# EAGLE schematic usbasp-dtoy (EAGLE 5.07)
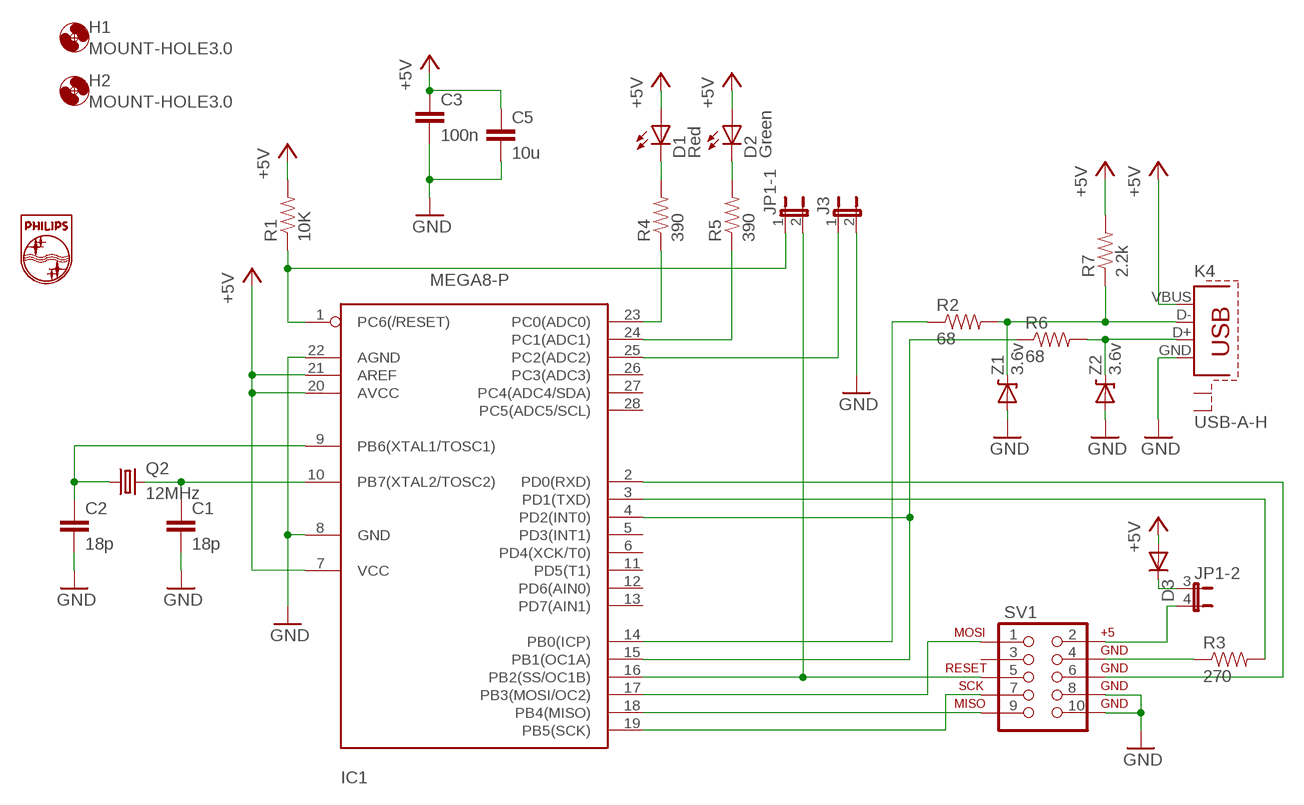
[diagram p0: schematic, sheet 1]

## Parts
C1  18p  C-EUC0805  [C0805]
C2  18p  C-EUC0805  [C0805]
C3  100n  CAPPTH1  [CAP-PTH-5MM]
C5  10u  C-EUC1206K  [C1206K]
D1  Red  LED3MM  [LED3MM]
D2  Green  LED3MM  [LED3MM]
D3  DIODE1N4148  [DIODE-1N4148]
H1  MOUNT-HOLE3.0  [3,0]
H2  MOUNT-HOLE3.0  [3,0]
IC1  MEGA8-P  [DIL28-3]
J3  JP1E  [JP1]
JP1  JP2QE-2X2  [JP2Q]
K4  USB-A-H  [USB-A-H]
Q2  12MHz  CRYSTALHC49UV  [HC49U-V]
R1  10K  RESISTOR1/4W  [AXIAL-0.3]
R2  68  RESISTOR0207/10  [0207/10]
R3  270  RESISTOR1/4W  [AXIAL-0.3]
R4  390  RESISTOR0207/10  [0207/10]
R5  390  RESISTOR0207/10  [0207/10]
R6  68  RESISTOR0207/10  [0207/10]
R7  2.2k  RESISTOR0207/10  [0207/10]
SV1  AVR_SPI_PROG2LOCK  [2X5-SHROUDED_LOCK]
Z1  3.6v  DIODE-ZENERPTH  [DIODE-ZENER]
Z2  3.6v  DIODE-ZENERPTH  [DIODE-ZENER]

## Nets
+5V: C3.1 C5.1 D1.A D2.A D3.A IC1.7(VCC) IC1.20(AVCC) IC1.21(AREF) K4.VBUS R1.P$2 R7.2
GND: C1.2 C2.2 C3.2 C5.2 IC1.8(GND) IC1.22(AGND) J3.2 K4.GND SV1.8 SV1.10 Z1.P$2(A) Z2.P$2(A)
N$1: K4.D- R2.2 R7.1 Z1.P$1(C)
N$2: K4.D+ R6.2 Z2.P$1(C)
N$3: C1.1 IC1.10(PB7(XTAL2/TOSC2)) Q2.2
N$4: C2.1 IC1.9(PB6(XTAL1/TOSC1)) Q2.1
N$5: JP1.4 SV1.2
N$6: R3.P$1 SV1.4
N$7: IC1.3(PD1(TXD)) R3.P$2
N$8: IC1.2(PD0(RXD)) SV1.6
N$9: IC1.17(PB3(MOSI/OC2)) SV1.1
N$10: IC1.19(PB5(SCK)) SV1.7
N$11: IC1.18(PB4(MISO)) SV1.9
N$12: IC1.16(PB2(SS/OC1B)) JP1.2 SV1.5
N$13: IC1.1(PC6(/RESET)) JP1.1 R1.P$1
N$14: IC1.14(PB0(ICP)) R2.1
N$15: IC1.25(PC2(ADC2)) J3.1
N$16: IC1.23(PC0(ADC0)) R4.1
N$17: IC1.24(PC1(ADC1)) R5.1
N$18: IC1.4(PD2(INT0)) IC1.15(PB1(OC1A)) R6.1
N$19: D1.K(C) R4.2
N$20: D2.K(C) R5.2
N$21: D3.C JP1.3
Unconnected: IC1.5(PD3(INT1)) IC1.6(PD4(XCK/T0)) IC1.11(PD5(T1)) IC1.12(PD6(AIN0)) IC1.13(PD7(AIN1)) IC1.26(PC3(ADC3)) IC1.27(PC4(ADC4/SDA)) IC1.28(PC5(ADC5/SCL)) K4.GND@1(S1) K4.GND@2(S2) SV1.3

## Library data of the parts
C1 C2 C5 = rcl:C-EU: CAPACITOR, European symbol
C3 = digital-toy:CAP: Capacitor Standard 0603 ceramic capacitor, and 0.1" leaded capacitor.
D1 D2 = digital-toy:LED: LEDs Standard schematic elements and footprints for 5mm, 3mm, 1206, and 0603 sized LEDs. 5mm - Spark Fun Electronics SKU : COM-00529 (and others) copy led.lbr 0805 led here, by hyl digital-toy. 2010.6.29
D3 = digital-toy:DIODE: Diode These are standard reverse protection diodes and small signal diodes. SMA package can handle up to about 1A. SOD-323 can handle about 200mA. What the SOD-323 package when ordering, there are some mfgs out there that are 5-pin packages.
H1 H2 = holes:MOUNT-HOLE: MOUNTING HOLE with drill center marker
IC1 = atmel:MEGA8-P: MICROCONTROLLER 8 Kbytes FLASH 1 kbytes SRAM 512 bytes EEPROM USART 4-channel 10 bit ADC 2-channel 8 bit ADC Source: avr.lbr
J3 = jumper:JP1E: JUMPER
JP1 = digital-toy:JP2QE: JUMPER
K4 = digital-toy:USB
Q2 = digital-toy:CRYSTAL: Crystals Various standard crystals. Proven footprints. Spark Fun Electronics SKU : COM-00534
R1-R7 = digital-toy:RESISTOR: Resistor Basic schematic elements and footprints for 0603, 1206, and PTH 1/10th watt (small) resistors. digital-toy copy vertical mount of axial-0.3 from rcl.lbr : the 0207/xx
SV1 = digital-toy:AVR_SPI_PROG2: AVR ICSP Header This is the standard AVR In Circuit Serial Programming header. Minimal, but includes pin one indicator. Works with standard Olimex programmers. Also look for the 6-pin reduced version. Spark Fun Electronics SKU: PRT-00778
Z1 Z2 = digital-toy:DIODE-ZENER: Zener Diode Production Part - 8199 3.4V Zener Voltage